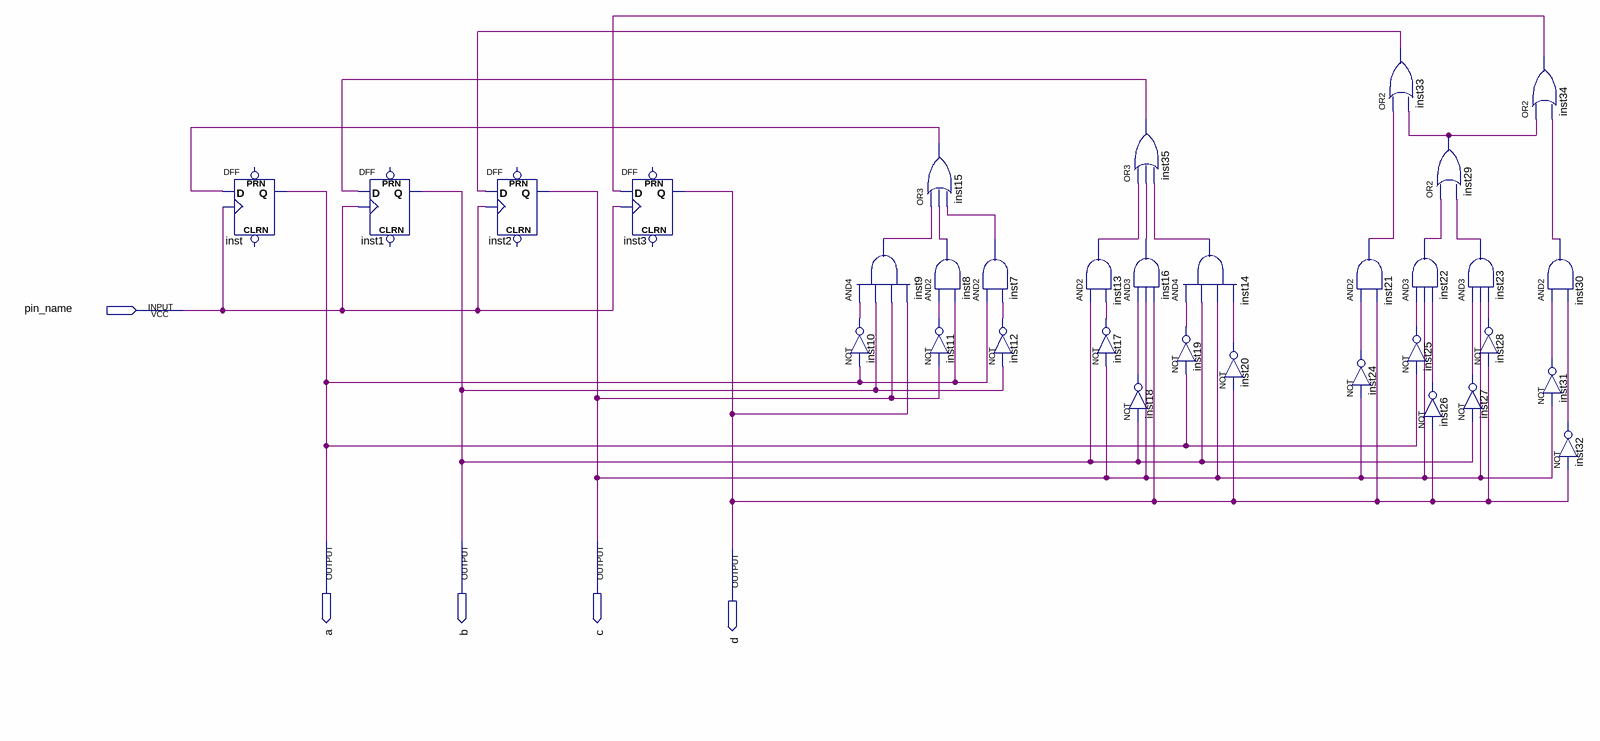
[diagram p0: schematic sheet]
// Quartus schematic ContadorMux.bdf as structural Verilog: 33 symbols, 5 pins
module ContadorMux (
  input  pin_name,
  output a,
  output b,
  output c,
  output d
);

  wire inst7_out, inst8_out, inst9_out, inst10_out, inst11_out, inst12_out, inst13_out, inst14_out,
       inst15_out, inst16_out, inst17_out, inst18_out, inst19_out, inst20_out, inst21_out, inst22_out,
       inst23_out, inst24_out, inst25_out, inst26_out, inst27_out, inst28_out, inst29_out, inst30_out,
       inst31_out, inst32_out, inst33_out, inst34_out, inst35_out;

  DFF inst (.CLK(pin_name), .D(inst15_out), .Q(a));  // open: CLRN, PRN
  DFF inst1 (.CLK(pin_name), .D(inst35_out), .Q(b));  // open: CLRN, PRN
  DFF inst2 (.CLK(pin_name), .D(inst33_out), .Q(c));  // open: CLRN, PRN
  DFF inst3 (.CLK(pin_name), .D(inst34_out), .Q(d));  // open: CLRN, PRN
  and inst9 (inst9_out, inst10_out, b, c, d);
  not inst10 (inst10_out, a);
  or inst15 (inst15_out, inst9_out, inst8_out, inst7_out);
  and inst8 (inst8_out, inst11_out, a);
  not inst11 (inst11_out, c);
  and inst7 (inst7_out, a, inst12_out);
  not inst12 (inst12_out, b);
  or inst35 (inst35_out, inst13_out, inst16_out, inst14_out);
  and inst13 (inst13_out, b, inst17_out);
  and inst16 (inst16_out, inst18_out, c, d);
  not inst17 (inst17_out, c);
  not inst18 (inst18_out, b);
  and inst14 (inst14_out, inst19_out, b, c, inst20_out);
  not inst19 (inst19_out, a);
  not inst20 (inst20_out, d);
  or inst33 (inst33_out, inst21_out, inst29_out);
  and inst21 (inst21_out, inst24_out, d);
  not inst24 (inst24_out, c);
  or inst29 (inst29_out, inst22_out, inst23_out);
  and inst22 (inst22_out, inst25_out, c, inst26_out);
  not inst25 (inst25_out, a);
  not inst26 (inst26_out, d);
  and inst23 (inst23_out, inst27_out, c, inst28_out);
  not inst28 (inst28_out, d);
  not inst27 (inst27_out, b);
  or inst34 (inst34_out, inst29_out, inst30_out);
  and inst30 (inst30_out, inst31_out, inst32_out);
  not inst31 (inst31_out, c);
  not inst32 (inst32_out, d);
endmodule
